# Altium schematic sheet rs485.SchDoc
size A4; SheetNumber: 13; SheetTotal: 14
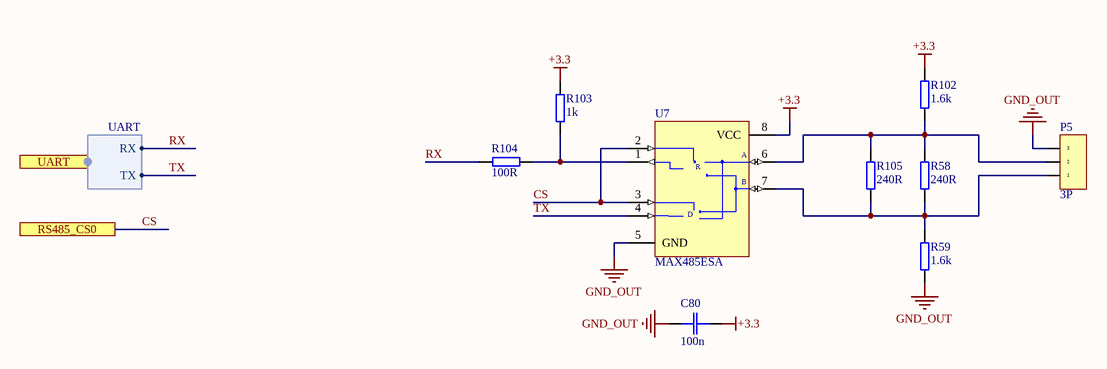
[diagram p0: rs485.SchDoc]

## Parts
C80  100n  [CAP: 0603]
P5  3P  [CON: 3P V 3.5mm]
R58  240R  [RES: 0603]
R59  1.6k  [RES: 0603]
R102  1.6k  [RES: 0603]
R103  1k  [RES: 0603]
R104  100R  [RES: 0603]
R105  240R  [RES: 0603]
U7  MAX485ESA  [NSO8_N]

## Ports
RS485_CS0, UART (harness UART)

## Harnesses
UART: RX, TX

## Nets
+3.3: C80.2 R102.1 R103.1 U7.8(VCC)
GND_OUT: C80.1 P5.3 R59.2 U7.5(GND)
CS: U7.2(~{RE}) U7.3(DE) ; port RS485_CS0
RX: R104.2 ; port UART.RX
TX: U7.4(DI) ; port UART.TX
NetP5_1: P5.1 R58.2 R59.1 R105.2 U7.7(B)
NetP5_2: P5.2 R58.1 R102.2 R105.1 U7.6(A)
NetR103_2: R103.2 R104.1 U7.1(RO)

## Notes on the sheet
- (in symbol MAX485ESA) R; D

## Library data of the parts
C80 = C_SMD: Value: 100n
R58 R59 R102-R105 = R_SMD
  R58 R105: Value: 240R
  R59 R102: Value: 1.6k
  R103: Value: 1k
  R104: Value: 100R
U7 = MAX485ESA: Low-Power, Slew-Rate-Limited RS-485/RS-422 Transceiver; Published: 16-Jan-2001; LatestRevisionDate: 13-Apr-2006; LatestRevisionNote: IPC-7351 Footprint Added.; DatasheetVersion: Feb-1996; PackageReference: NSO8; Publisher: Altium Limited; PackageDescription: 8-Pin Small Outline Integrated Circuit 1.27 mm Pitch; Code_JEDEC: MS-012-AA; Code_IPC: SOIC127P600-8; ComponentLink1Description: Manufacturer Link; ComponentLink1URL: http://www.maxim-ic.com/; ComponentLink2Description: Datasheet; ComponentLink2URL: http://pdfserv.maxim-ic.com/en/ds/MAX1487-MAX491.pdf
P5 = 3P: Value: 3P